# EAGLE design AC_Switch_Proto (EAGLE 7.2.0)
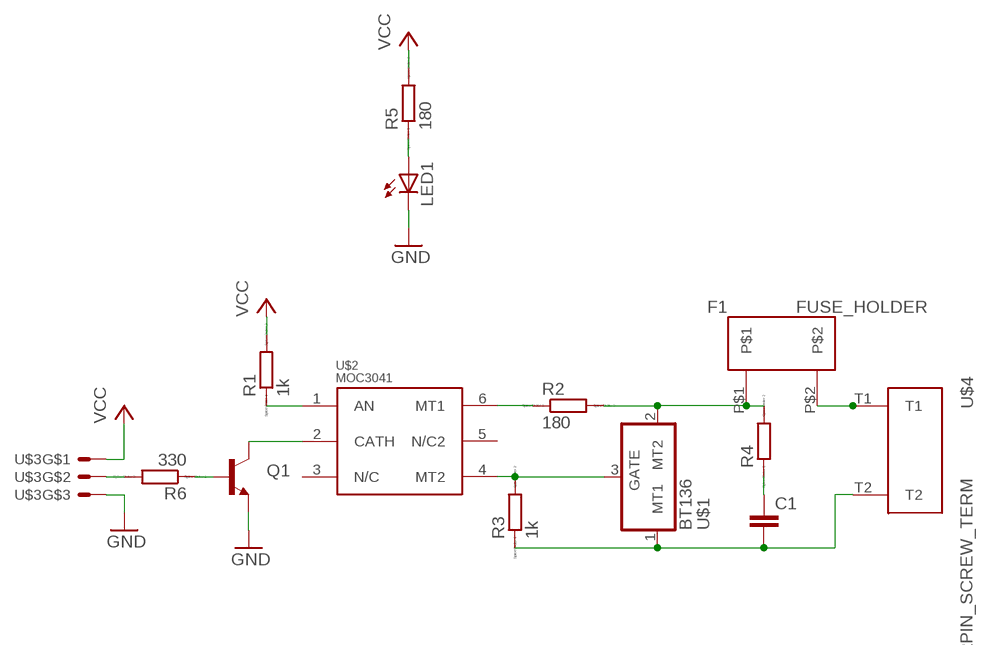
[diagram p0: schematic, sheet 1]

## Parts
C1  C-EU050-030X075  [C050-030X075]
F1  FUSE_HOLDER  [FUSE_HOLDER]
LED1  LED3MM  [LED3MM]
Q1  TRANSISTOR_NPNBC547  [TO-92-AMMO]
R1  1k  R0207/10  [0207/10]
R2  180  R0207/10  [0207/10]
R3  1k  R0207/10  [0207/10]
R4  R0207/10  [0207/10]
R5  180  R0207/10  [0207/10]
R6  330  R0207/10  [0207/10]
U$1  BT136  [BT136]
U$2  MOC3041  [MOC3041]
U$3  3PINHEADER  [3PINHEADER]
U$4  2PIN_SCREW_TERM  [2PIN_SCREW_TERM]

## Nets
GND: LED1.K(C) Q1.3(E) U$3.N2
N$1: R6.2 U$3.N1
N$2: Q1.1(C) U$2.2(CATH)
N$3: R1.1 U$2.1(AN)
N$4: Q1.2(B) R6.1
N$5: F1.P$1 R2.2 R4.2 U$1.2(MT2)
N$6: R2.1 U$2.6(MT1)
N$7: C1.2 R3.1 U$1.1(MT1) U$4.T2
N$9: R3.2 U$1.3(GATE) U$2.4(MT2)
N$11: F1.P$2 U$4.T1
N$31: C1.1 R4.1
N$35: LED1.A R5.1
VCC: R1.2 R5.2 U$3.N0
Unconnected: U$2.3(N/C) U$2.5(N/C2)

## Library data of the parts
C1 = rcl:C-EU: CAPACITOR, European symbol
F1 = ForceTronics:FUSE_HOLDER: 5mm x 20mm Fuse Holder
LED1 = led:LED: LED OSRAM: - CHIPLED LG R971, LG N971, LY N971, LG Q971, LY Q971, LO R971, LY R971 LH N974, LH R974 LS Q976, LO Q976, LY Q976 LO Q996 - Hyper CHIPLED LW Q18S LB Q993, LB Q99A, LB R99A - SideLED LS A670, LO A670, LY A670, LG A670, LP A670 LB A673, LV A673, LT A673, LW A673 LH A674 LY A675 LS A676, LA A676, LO A676, LY A676, LW A676 LS A679, LY A679, LG A679 - Hyper Micro SIDELEDÂ® LS Y876, LA Y876, LO Y876, LY Y876 LT Y87S - SmartLED LW L88C, LW L88S LB L89C, LB L89S, LG L890 LS L89K, LO L89K, LY L89K LS L896, LA L896, LO L896, LY L896 - TOPLED LS T670, LO T670, LY T670, LG T670, LP T670 LSG T670, LSP T670, LSY T670, LOP T670, LYG T670 LG T671, LOG T671, LSG T671 LB T673, LV T673, LT T673, LW T673 LH T674 LS T676, LA T676, LO T676, LY T676, LB T676, LH T676, LSB T676, LW T676 LB T67C, LV T67C, LT T67C, LS T67K, LO T67K, LY T67K, LW E67C LS E67B, LA E67B, LO E67B, LY E67B, LB E67C, LV E67C, LT E67C LW T67C LS T679, LY T679, LG T679 LS T770, LO T770, LY T770, LG T770, LP T770 LB T773, LV T773, LT T773, LW T773 LH T774 LS E675, LA E675, LY E675, LS T675 LS T776, LA T776, LO T776, LY T776, LB T776 LHGB T686 LT T68C, LB T68C - Hyper Mini TOPLEDÂ® LB M676 - Mini TOPLED SantanaÂ® LG M470 LS M47K, LO M47K, LY M47K Source: http://www.osram.convergy.de LUXEON: - LUMILEDÂ® LXK2-PW12-R00, LXK2-PW12-S00, LXK2-PW14-U00, LXK2-PW14-V00 LXK2-PM12-R00, LXK2-PM12-S00, LXK2-PM14-U00 LXK2-PE12-Q00, LXK2-PE12-R00, LXK2-PE12-S00, LXK2-PE14-T00, LXK2-PE14-U00 LXK2-PB12-K00, LXK2-PB12-L00, LXK2-PB12-M00, LXK2-PB14-N00, LXK2-PB14-P00, LXK2-PB14-Q00 LXK2-PR12-L00, LXK2-PR12-M00, LXK2-PR14-Q00, LXK2-PR14-R00 LXK2-PD12-Q00, LXK2-PD12-R00, LXK2-PD12-S00 LXK2-PH12-R00, LXK2-PH12-S00 LXK2-PL12-P00, LXK2-PL12-Q00, LXK2-PL12-R00 Source: www.luxeon.com KINGBRIGHT: KA-3528ASYC Source: www.kingbright.com
Q1 = SparkFun-DiscreteSemi:TRANSISTOR_NPN: Generic NPN BJT MMBT2222A - TRANS-08049 (SOT-23, 1A 40V) MPSA42 - TRANS-09116 (SOT-23, 500mA 300V) MMBT5088LT1G - TRANS-11160 (SOT-23, 50 mA 30V) BC547 - COM-08928 <http://www.sparkfun.com/products/8928> (TO-92 45V 100mA) (1.Collector 2.Base 3.Emitter) 2N3904 - COM-00521 <http://www.sparkfun.com/products/521> (TO-92 40V 200mA) (1.Emitter 2.Base 3.Collector) P2N2222A - COM-12852 <http://www.sparkfun.com/products/12852> (TO-92 40V 600mA) (1.Collector 2.Base 3.Emitter)
R1-R6 = eagle-ltspice:R: RESISTOR, European symbol; SPICEMODEL: NONE; SPICEPREFIX: R
U$1 = ForceTronics:BT136: BT136 Triac: pin 1 is main terminal 1, pin 2 is main terminal 2, pin 3 is Gate
U$2 = ForceTronics:MOC3041: MOC 3041 opto isolator: pin 1 is anode, pin 2 is cathode, pin 3 is N/C, pin 4 is MT2, pin 5 is N/C, pin 6 is MT1
U$3 = ForceTronics:3PINHEADER: 3 pin header with oval copper
U$4 = ForceTronics:2PIN_SCREW_TERM: 2 pin screw terminal 5mm pin spacing 10mm length 8mm depth

## Board
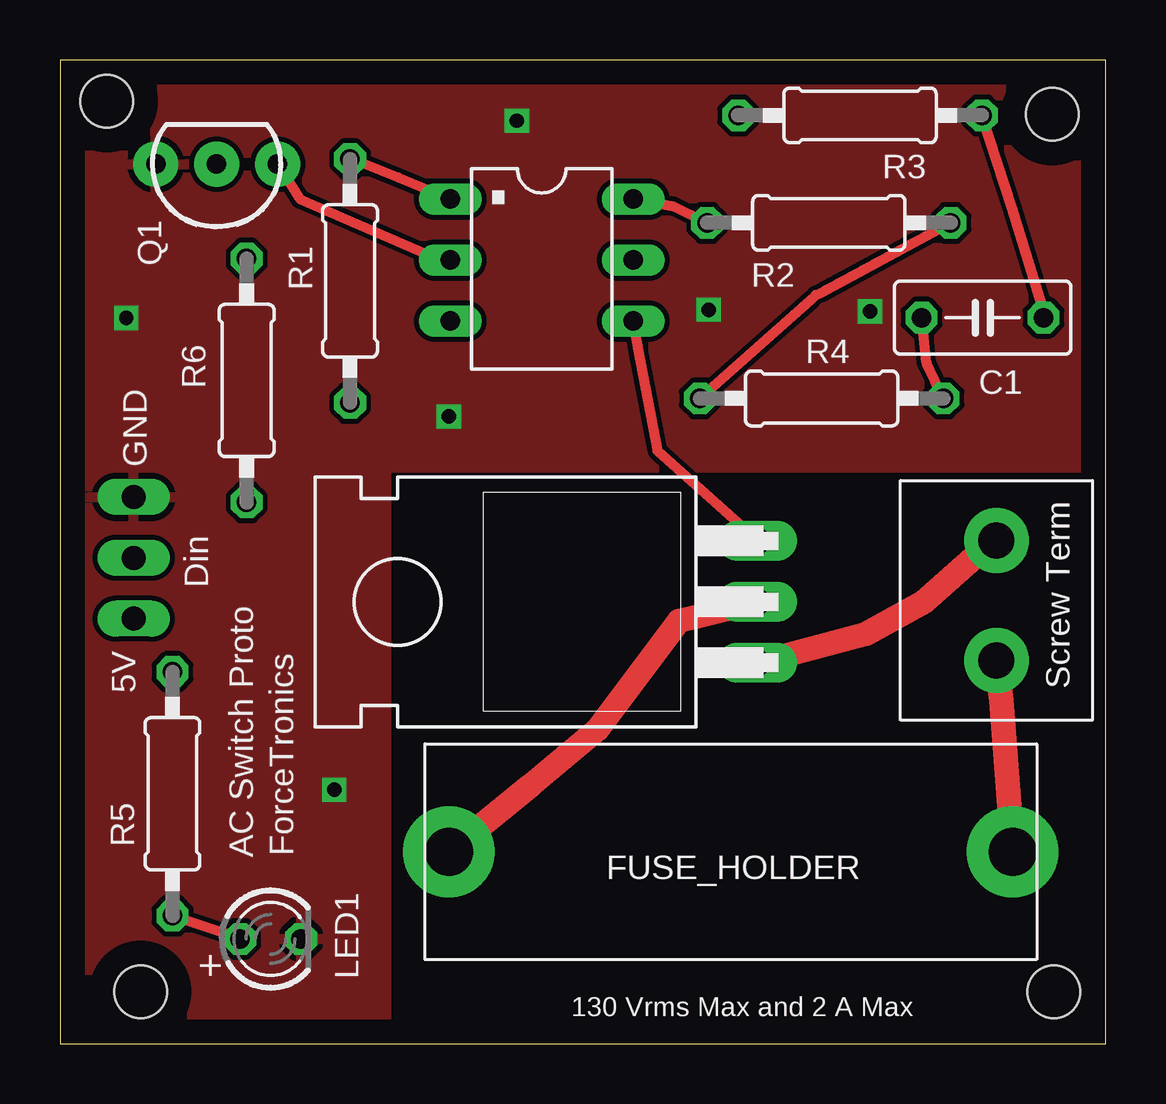
[diagram p1: board, top side]
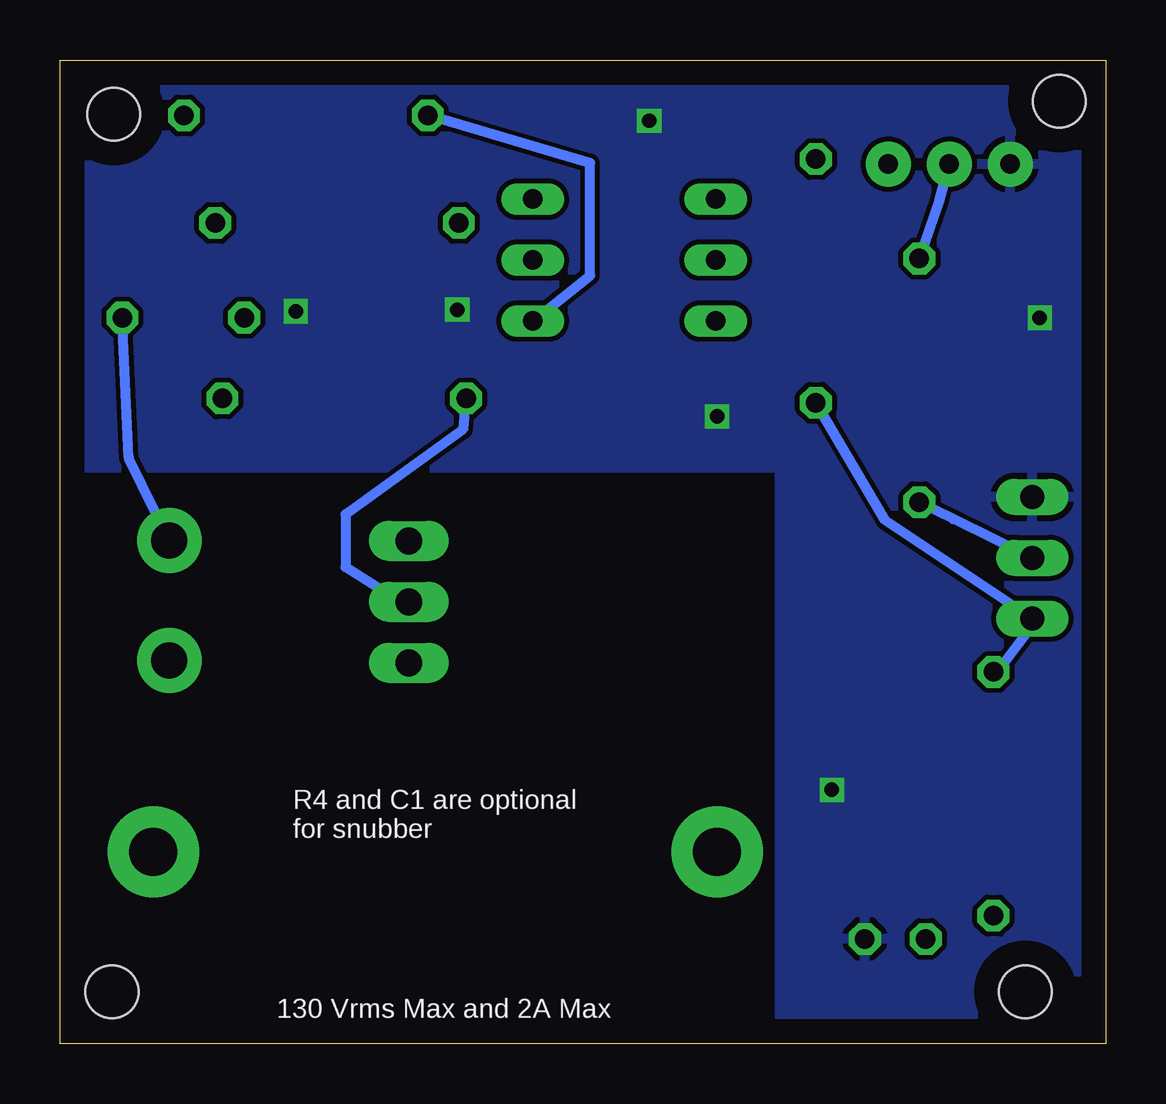
[diagram p2: board, bottom side, seen from below]

Size 43.6 x 41 mm. Coordinates in mm from the lower left corner, seen from the top.
Outline: 0,0 43.6,0 43.6,41 0,41 0,0
Copper layers (1*16): Top 0.035mm / dielectric 1.5mm / Bottom 0.035mm
Design rules "default": minimum track width 10mil, minimum drill 24mil, track to track 8mil, track to pad 8mil, pad to pad 8mil, via to via 8mil, smd to smd 8mil, copper to edge 40mil, drill to drill 8mil, minimum pad ring 10mil, minimum via ring 8mil, stop-mask expansion 4mil, vias tented up to drill 0mil, thermal gap 10mil
Holes 2.2 mm at 41.36,38.74 1.95,39.28 3.36,2.16 41.43,2.16

### Footprints (pad centres in the part's own frame; a part is rotated, then mirrored left to right if it is on the bottom)
C050-030X075 = drill 0.813 octagon: 1 -2.54,0; 2 2.54,0
FUSE_HOLDER = drill 2 pad 3.81: P$1 1,4.5; P$2 24.5,4.5
LED3MM = drill 0.813 octagon: A -1.27,0; K 1.27,0
TO-92-AMMO = drill 0.813 pad 1.88: 1 -2.54,0; 2 0,0; 3 2.54,0
0207/10 = drill 0.813 octagon: 1 -5.08,0; 2 5.08,0
BT136 = drill 1.118 long: 1 2.54,-2.54; 2 5.08,-2.54; 3 7.62,-2.54
MOC3041 = drill 0.813 long: 1 1.26,-0.86; 2 3.8,-0.86; 3 6.34,-0.86; 4 6.34,6.76; 5 3.8,6.76; 6 1.26,6.76
3PINHEADER = drill 1 long: N0 1.27,1.27; N1 3.81,1.27; N2 6.35,1.27
2PIN_SCREW_TERM = drill 1.5 pad 2.7: T1 2.5,4; T2 7.5,4

### Placement (x,y rotation side)
C1  38.46,30.26 0 top
F1  15.21,3.49 0 top
LED1  8.78,4.36 0 top
Q1  6.53,36.66 180 top
R1  12.09,31.79 270 top
R2  32.05,34.21 0 top
R3  33.35,38.69 180 top
R4  31.75,26.89 180 top
R5  4.69,10.41 90 top
R6  7.78,27.64 270 top
U$1  26.52,13.33 90 top
U$2  17.13,36.46 270 top
U$3  4.34,16.44 90 top
U$4  43.04,13.47 90 top

### Tracks (layer width: path | path; a pad name or v marks a point on that pad's centre or on a via)
GND  (via drill 0.6)
  other vias: 2.76,30.25 11.43,10.58 16.21,26.14 19.04,38.47 27.04,30.59 33.77,30.52
  pour Bottom: -2.4,42 -2.4,-1 13.6,-1 13.6,24 44.6,24 44.6,42
  pour Top: -2.4,-1 -2.4,42 44.6,42 44.6,24 13.6,24 13.6,-1
N$1
  Bottom 0.406: U$3.N1 6.37,21.86 R6.2
N$2
  Top 0.406: Q1.1 9.3,36.32 10,35.2 16.27,32.5 U$2.2
N$3
  Top 0.406: U$2.1 14.1,36.1 12.09,36.9 R1.1
N$4
  Bottom 0.406: R6.1 6.94,35.14 Q1.2
N$5
  Top 0.406: R4.2 31.3,30.99 31.5,31.2 31.73,31.3 R2.2
  Top 1.016: U$1.2 25.8,17.61 22.4,13.1 19.59,10.73 F1.P$1
  Bottom 0.406: R4.2 26.7,26.89 26.8,25.6 31.7,22.06 31.7,19.86 29.06,18.2 U$1.2
N$6
  Top 0.406: U$2.6 25.57,34.9 R2.1
N$7
  Top 0.406: C1.2 41.1,30.26 39.7,34.8 R3.1
  Top 1.016: U$1.1 33.6,17.07 36,18.4 39.04,21.1 U$4.T2
  Bottom 0.406: U$4.T2 40.73,24.41 C1.2
N$9
  Top 0.406: U$2.4 24.1,28.92 24.9,24.7 29.06,21 U$1.3
  Bottom 0.406: U$2.4 21.5,32.02 21.5,36.7 R3.2
N$11
  Top 1.016: U$4.T1 39.24,14.31 F1.P$2
N$31
  Top 0.406: R4.1 36.12,28.39 C1.1
N$35
  Top 0.406: R5.1 7.51,4.38 LED1.A
VCC
  Bottom 0.406: R1.2 9.19,21.81 U$3.N0 2.89,17.71 2.95,17.59 4.42,15.63 R5.2

### Text on the board
tNames: . | GND | Din | 5V | Screw Term | AC Switch Proto | ForceTronics | + | 130 Vrms Max and 2 A Max
bNames: R4 and C1 are optional / for snubber | 130 Vrms Max and 2A Max